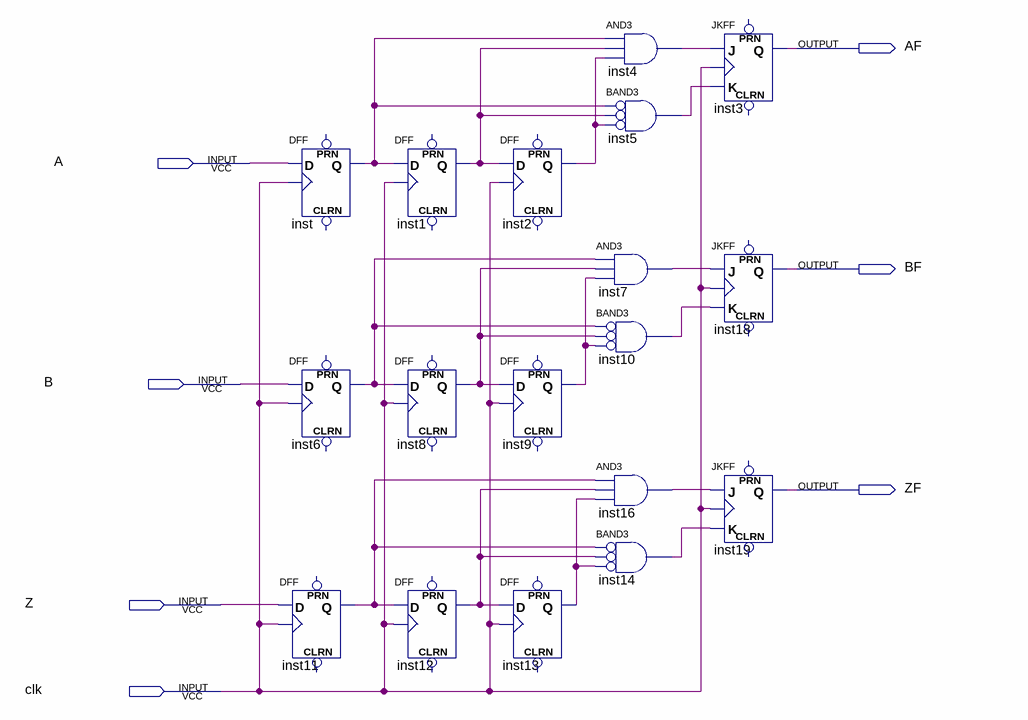
[diagram p0: schematic sheet]
// Quartus schematic encoder_filter.bdf as structural Verilog: 18 symbols, 7 pins
module encoder_filter (
  input  A,
  input  B,
  input  Z,
  input  clk,
  output AF,
  output BF,
  output ZF
);

  wire inst1_q, inst2_q, inst4_out, inst5_out, inst6_q, inst7_out, inst8_q, inst9_q, inst10_out, inst11_q,
       inst12_q, inst13_q, inst14_out, inst16_out, inst_q;

  DFF inst11 (.CLK(clk), .D(Z), .Q(inst11_q));  // open: CLRN, PRN
  DFF inst (.CLK(clk), .D(A), .Q(inst_q));  // open: CLRN, PRN
  DFF inst6 (.CLK(clk), .D(B), .Q(inst6_q));  // open: CLRN, PRN
  DFF inst1 (.CLK(clk), .D(inst_q), .Q(inst1_q));  // open: CLRN, PRN
  DFF inst8 (.CLK(clk), .D(inst6_q), .Q(inst8_q));  // open: CLRN, PRN
  DFF inst12 (.CLK(clk), .D(inst11_q), .Q(inst12_q));  // open: CLRN, PRN
  DFF inst2 (.CLK(clk), .D(inst1_q), .Q(inst2_q));  // open: CLRN, PRN
  DFF inst9 (.CLK(clk), .D(inst8_q), .Q(inst9_q));  // open: CLRN, PRN
  DFF inst13 (.CLK(clk), .D(inst12_q), .Q(inst13_q));  // open: CLRN, PRN
  and inst4 (inst4_out, inst_q, inst1_q, inst2_q);
  and inst5 (inst5_out, ~inst_q, ~inst1_q, ~inst2_q);  // BAND3
  and inst7 (inst7_out, inst6_q, inst8_q, inst9_q);
  and inst10 (inst10_out, ~inst6_q, ~inst8_q, ~inst9_q);  // BAND3
  and inst16 (inst16_out, inst11_q, inst12_q, inst13_q);
  and inst14 (inst14_out, ~inst11_q, ~inst12_q, ~inst13_q);  // BAND3
  JKFF inst3 (.K(inst5_out), .J(inst4_out), .CLK(clk), .Q(AF));  // open: PRN, CLRN
  JKFF inst18 (.K(inst10_out), .J(inst7_out), .CLK(clk), .Q(BF));  // open: PRN, CLRN
  JKFF inst19 (.K(inst14_out), .J(inst16_out), .CLK(clk), .Q(ZF));  // open: PRN, CLRN
endmodule
